# EAGLE design Motor Controller and Boost (EAGLE 8.3.0)
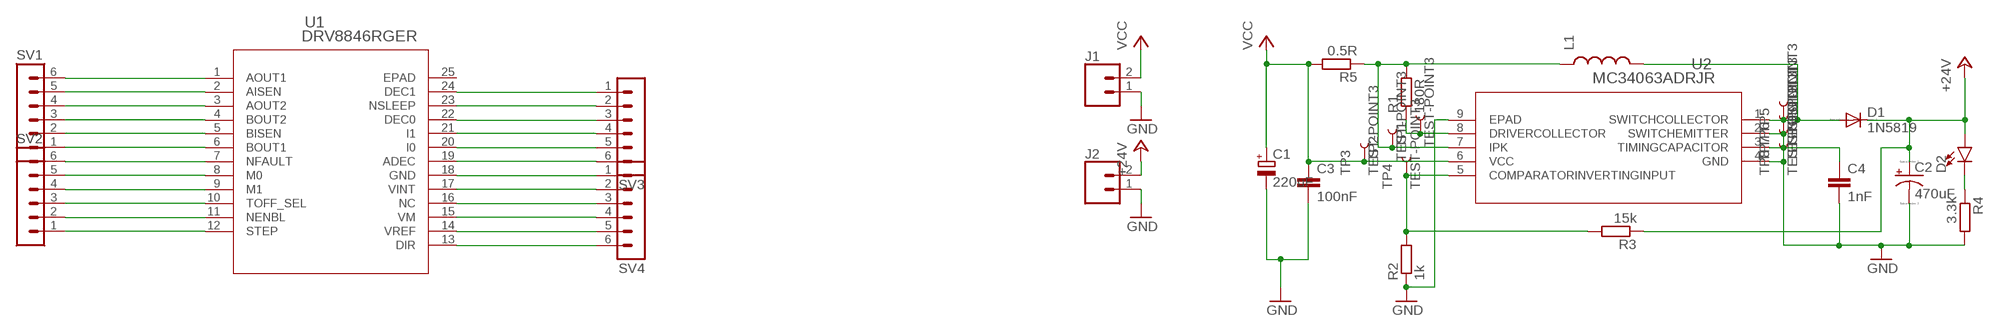
[diagram p0: schematic, sheet 1]

## Parts
C1  220uF  CPOL-EUSMCC  [SMC_C]
C2  470uF  CPOL-US153CLV-1010  [153CLV-1010]
C3  100nF  C-EUC0603  [C0603]
C4  1nF  C-EUC0603  [C0603]
D1  1N5819  [SOD123]
D2  LED0603  [LED-0603]
J1  CONN_02  [1X02]
J2  CONN_02  [1X02]
L1  INDUCTORCR54  [CR54]
R1  180R  R-EU_R0603  [R0603]
R2  1k  R-EU_R0603  [R0603]
R3  15k  R-EU_R0603  [R0603]
R4  3.3k  R-EU_R0603  [R0603]
R5  0.5R  R-EU_R0603  [R0603]
SV1  MA06-1  [MA06-1]
SV2  MA06-1  [MA06-1]
SV3  MA06-1  [MA06-1]
SV4  MA06-1  [MA06-1]
TP1  TEST-POINT3  [PAD.03X.03]
TP2  TEST-POINT3  [PAD.03X.03]
TP3  TEST-POINT3  [PAD.03X.03]
TP4  TEST-POINT3  [PAD.03X.03]
TP5  TEST-POINT3  [PAD.03X.03]
TP6  TEST-POINT3  [PAD.03X.03]
TP7  TEST-POINT3  [PAD.03X.03]
TP8  TEST-POINT3  [PAD.03X.03]
U1  DRV8846RGER  [RGE24_2P45X2P45]
U2  MC34063ADRJR  [DRJ8_2P2X3]

## Nets
+24V: C2.+ D1.C D2.A J2.2 R3.1
GND: C1.- C2.- C3.2 C4.2 J1.1 J2.1 R2.1 R4.2 TP6.P$1 TP8.P$1 U2.2(SWITCHEMITTER) U2.4(GND) U2.9(EPAD)
N$1: SV1.6 U1.1(AOUT1)
N$2: SV1.5 U1.2(AISEN)
N$3: SV1.4 U1.3(AOUT2)
N$4: SV1.3 U1.4(BOUT2)
N$5: SV1.1 U1.6(BOUT1)
N$6: SV1.2 U1.5(BISEN)
N$7: SV2.6 U1.7(NFAULT)
N$8: SV2.5 U1.8(M0)
N$9: SV2.4 U1.9(M1)
N$10: SV2.3 U1.10(TOFF_SEL)
N$11: SV2.2 U1.11(NENBL)
N$12: SV2.1 U1.12(STEP)
N$13: SV4.6 U1.13(DIR)
N$14: SV4.5 U1.14(VREF)
N$15: SV4.4 U1.15(VM)
N$16: SV4.3 U1.16(NC)
N$17: SV4.2 U1.17(VINT)
N$18: SV4.1 U1.18(GND)
N$19: SV3.6 U1.19(ADEC)
N$20: SV3.5 U1.20(I0)
N$21: SV3.4 U1.21(I1)
N$22: SV3.3 U1.22(DEC0)
N$23: SV3.2 U1.23(NSLEEP)
N$24: SV3.1 U1.24(DEC1)
N$25: R2.2 R3.2 TP4.P$1 U2.5(COMPARATORINVERTINGINPUT)
N$26: R1.1 TP1.P$1 U2.8(DRIVERCOLLECTOR)
N$28: L1.P$1 R1.2 R5.1 TP2.P$1 U2.7(IPK)
N$31: C4.1 TP7.P$1 U2.3(TIMINGCAPACITOR)
N$32: D2.C R4.1
N$33: D1.A L1.P$2 TP5.P$1 U2.1(SWITCHCOLLECTOR)
VCC: C1.+ C3.1 J1.2 R5.2 TP3.P$1 U2.6(VCC)
Unconnected: U1.25(EPAD)

## Library data of the parts
C1 = resistor:CPOL-EU: POLARIZED CAPACITOR, European symbol
C2 = resistor:CPOL-US: POLARIZED CAPACITOR, American symbol
C3 C4 = resistor:C-EU: CAPACITOR, European symbol
D1 = Beeclust:1N5819: SCHOTTKY BARRIER RECTIFIER Source: http://onsemi.com .. MBR0520LT1-D.pdf
D2 = SparkFun-LED:LED: LED (Generic) Standard schematic elements and footprints for 5mm, 3mm, 1206, and 0603 sized LEDs. Generic LEDs with no color specified.
J1 J2 = SparkFun-Connectors:CONN_02: Multi connection point. Often used as Generic Header-pin footprint for 0.1 inch spaced/style header connections On any of the 0.1 inch spaced packages, you can populate with these: Break Away Headers - Straight <https://www.sparkfun.com/products/116> (PRT-00116) Break Away Male Headers - Right Angle <https://www.sparkfun.com/products/553> (PRT-00553) Female Headers <https://www.sparkfun.com/products/115> (PRT-00115) Break Away Headers - Machine Pin <https://www.sparkfun.com/products/117> (PRT-00117) Break Away Female Headers - Swiss Machine Pin <https://www.sparkfun.com/products/743> (PRT-00743) For SCREWTERMINALS and SPRING TERMINALS visit here: Screw Terimnals on SparkFun.com <https://www.sparkfun.com/search/results?term=Screw+Terminals> (5mm/3.5mm/2.54mm spacing) This device is also useful as a general connection point to wire up your design to another part of your project. Our various solder wires solder well into these plated through hole pads. Hook-Up Wire - Assortment (Stranded, 22 AWG) <https://www.sparkfun.com/products/11375> (PRT-11375) Hook-Up Wire - Assortment (Solid Core, 22 AWG) <https://www.sparkfun.com/products/11367> (PRT-11367) View the entire wire category on our website here <https://www.sparkfun.com/categories/141> Special notes: Molex polarized connector foot print use with: PRT-08233 with associated crimp pins and housings. 2.54_SCREWTERM for use with PRT-10571. 3.5mm Screw Terminal footprints for PRT-08084 5mm Screw Terminal footprints for use with PRT-08432
L1 = adjacent-reality:INDUCTOR: Inductors Basic Inductor/Choke - 0603 and 1206. Footprints are not proven and vary greatly between part numbers. CC-BY-SA from SparkFun
R1-R5 = resistor:R-EU_: RESISTOR, European symbol
SV1-SV4 = con-lstb:MA06-1: PIN HEADER; OC_FARNELL: unknown; OC_NEWARK: unknown
TP1-TP8 = SparkFun-Connectors:TEST-POINT: SparkFun Test Points Bare copper test points for troubleshooting or In-Circuit-Testing. These are used by our Production team for verifying production board runs using pogo-pins on test beds. SparkFun Products: SparkFun LSM9DS1 Breakout <https://www.sparkfun.com/products/13284> SparkFun PSOC <https://www.sparkfun.com/products/13714> SparkFun Load Cell Amplifier <https://www.sparkfun.com/products/13879>
U1 = Beeclust:DRV8846RGER; MANUFACTURER_PART_NUMBER: drv8846rger; VENDOR: Texas Instruments
U2 = Beeclust:MC34063ADRJR; MANUFACTURER_PART_NUMBER: MC34063ADRJR; VENDOR: Vendor

## Board
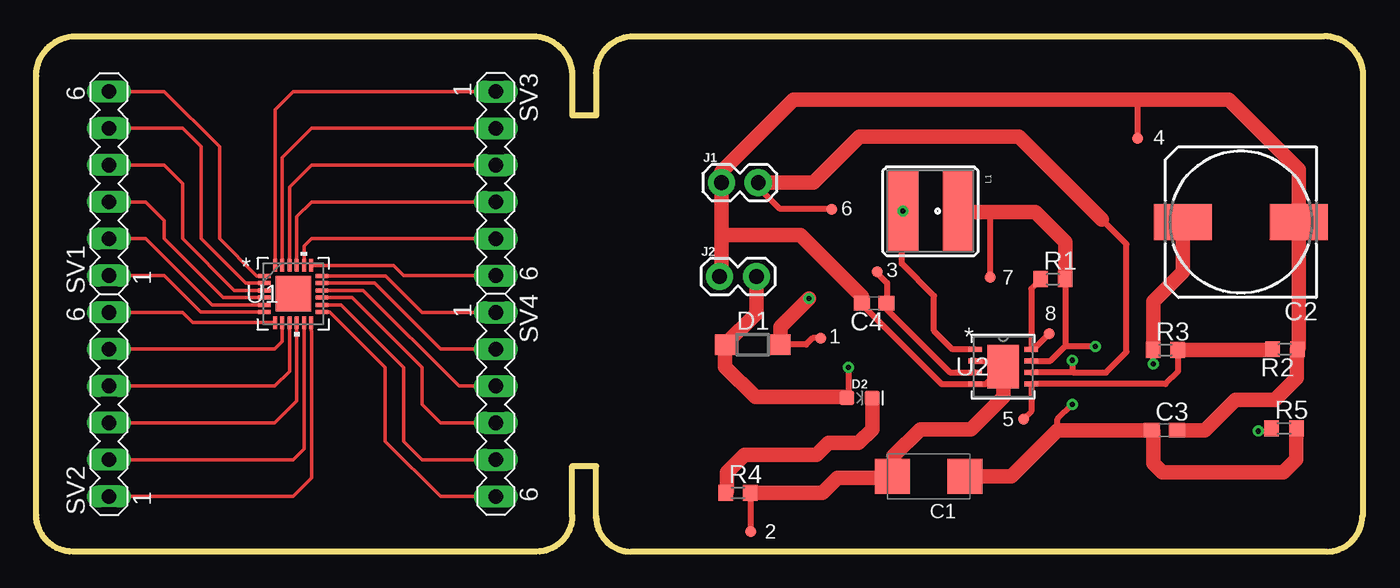
[diagram p1: board, top side]
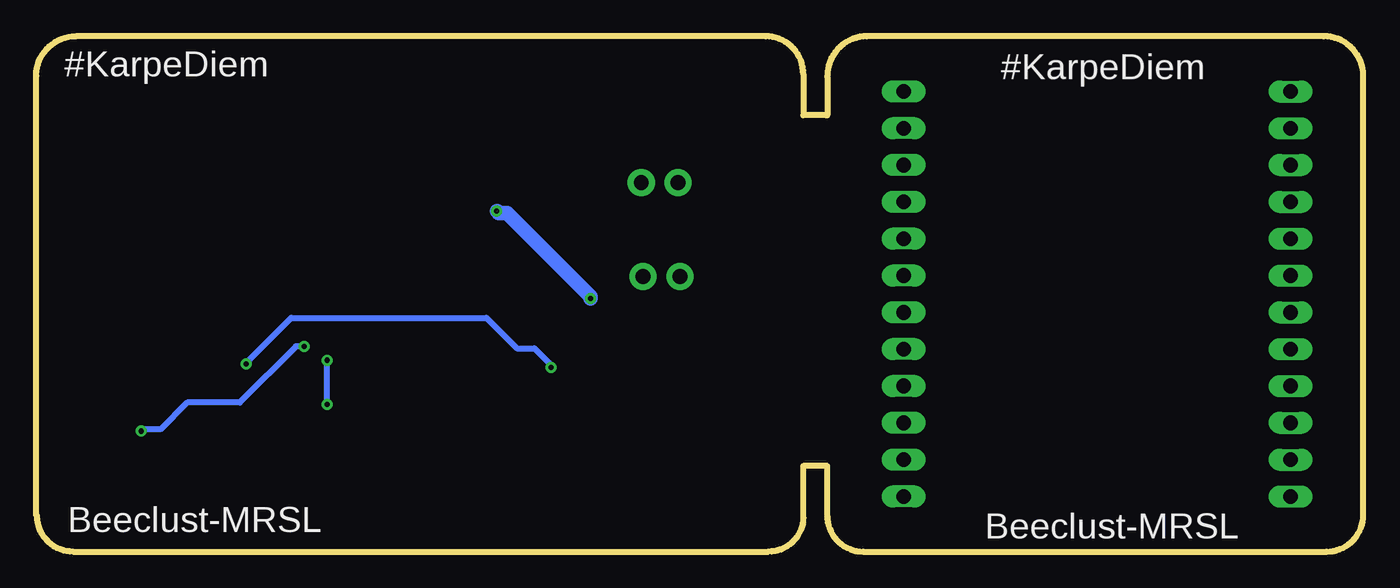
[diagram p2: board, bottom side, seen from below]

Size 91.5 x 35.56 mm. Coordinates in mm from the lower left corner, seen from the top.
Outline: 36.96,32.83 arc90 34.23,35.56 2.73,35.56 arc90 0,32.83 0,2.54 arc90 2.54,0 34.48,0 arc90 36.96,2.48
Outline: 38.61,2.41 arc90 41.02,0 88.96,0 arc90 91.44,2.48
Outline: 91.5,32.83 arc90 88.77,35.56 41.21,35.56 arc90 38.61,32.96 38.61,30.1 37.02,30.1
Outline: 91.5,2.48 91.5,33.15
Outline: 38.61,2.29 38.61,5.91 36.96,5.91 36.96,2.41
Outline: 36.96,32.77 36.96,30.1
Copper layers (1*16): Top 0.035mm / dielectric 1.5mm / Bottom 0.035mm
Design rules "default": minimum track width 10mil, minimum drill 24mil, track to track 8mil, track to pad 8mil, pad to pad 8mil, via to via 8mil, smd to smd 8mil, copper to edge 40mil, drill to drill 8mil, minimum pad ring 10mil, minimum via ring 8mil, stop-mask expansion 4mil, vias tented up to drill 0mil, thermal gap 10mil

### Footprints (pad centres in the part's own frame; a part is rotated, then mirrored left to right if it is on the bottom)
SMC_C = smd 2.4 x 2.4: + -2.5,0; - 2.5,0
153CLV-1010 = smd 4 x 2.5: + 4,0; - -4,0
C0603 = smd 1.1 x 1: 1 -0.85,0; 2 0.85,0
SOD123 = smd 1.4 x 1.4: A 1.9,0; C -1.9,0
LED-0603 = smd 1 x 1: A -0.877,0; C 0.877,0
1X02 = drill 1.016 pad 1.88: 1 0,0; 2 2.54,0
CR54 = smd 5.5 x 2.15: P$1 0,1.92; P$2 0,-1.92
R0603 = smd 1 x 1.1: 1 -0.85,0; 2 0.85,0
MA06-1 = drill 1.016 long: 1 -6.35,0; 2 -3.81,0; 3 -1.27,0; 4 1.27,0; 5 3.81,0; 6 6.35,0
PAD.03X.03 = smd 0.762 x 0.762: P$1 0,0
RGE24_2P45X2P45 = smd 0.85 x 0.28: 1 -1.975,1.25; 2 -1.975,0.75; 3 -1.975,0.25; 4 -1.975,-0.25; 5 -1.975,-0.75; 6 -1.975,-1.25; 13 1.975,-1.25; 14 1.975,-0.75; 15 1.975,-0.25; 16 1.975,0.25; 17 1.975,0.75; 18 1.975,1.25 | smd 0.28 x 0.85: 7 -1.25,-1.975; 8 -0.75,-1.975; 9 -0.25,-1.975; 10 0.25,-1.975; 11 0.75,-1.975; 12 1.25,-1.975; 19 1.25,1.975; 20 0.75,1.975; 21 0.25,1.975; 22 -0.25,1.975; 23 -0.75,1.975; 24 -1.25,1.975 | smd 2.45 x 2.45: 25 0,0
DRJ8_2P2X3 = smd 0.95 x 0.35: 1 -1.93,1.2; 2 -1.93,0.4; 3 -1.93,-0.4; 4 -1.93,-1.2; 5 1.93,-1.2; 6 1.93,-0.4; 7 1.93,0.4; 8 1.93,1.2 | smd 2.2 x 3: 9 0,0

### Placement (x,y rotation side)
C1  61.53,5.21 180 top
C2  83.06,22.73 180 top
C3  77.79,8.38 0 top
C4  57.79,17.14 180 top
D1  49.4,14.29 0 top
D2  56.77,10.6 0 top
J1  47.24,25.46 0 top
J2  47.12,18.99 0 top
L1  61.66,23.5 270 top
R1  70.1,18.8 0 top
R2  86.11,13.97 180 top
R3  77.85,13.91 0 top
R4  48.39,4.06 0 top
R5  86.04,8.51 0 top
SV1  5.02,25.4 90 top
SV2  5.02,10.16 90 top
SV3  31.69,25.4 270 top
SV4  31.69,10.16 270 top
TP1  69.85,15.05 0 top
TP2  65.79,18.92 0 top
TP3  54.86,23.62 0 top
TP4  68.07,9.14 0 top
TP5  54.1,14.73 0 top
TP6  49.28,1.4 0 top
TP7  57.98,19.3 0 top
TP8  75.95,28.51 0 top
U1  17.72,17.78 0 top
U2  66.67,12.76 0 top

### Tracks (layer width: path | path; a pad name or v marks a point on that pad's centre or on a via)
+24V  (via drill 0.35)
  Top 0.406: R3.1 77,12.98 v77.03,12.95 | v56.01,12.7 56.01,10.72 D2.A
  Top 1.016: C2.+ 79.06,19.3 77.03,17.27 77.03,13.93 R3.1 | D2.A 55.83,10.67 49.59,10.67 47.5,12.76 D1.C 49.66,16.44 J2.2
  Bottom 0.406: v77.03,12.95 77.03,13.02 73.91,16.13 60.45,16.13 58.36,14.03 57.15,14.03 55.94,12.83 55.94,12.76 v56.01,12.7
GND
  Top 0.406: C4.2 56.93,17.04 62.42,11.56 U2.4 65.47,11.56 U2.9 66.27,13.16 U2.2 | 59.12,6.79 59.12,6.61 59.12,6.04 | R4.2 49.24,1.44 TP6.P$1 | TP8.P$1 75.95,31.06 75.83,31.18
  Top 1.016: 47.24,21.83 J1.1 47.24,26.23 52.2,31.18 75.83,31.18 82.23,31.18 87.06,26.35 C2.- 87.06,14.07 R2.1 86.93,13.95 86.93,12 85.41,10.48 82.68,10.48 80.58,8.38 C3.2 | 47.24,21.83 47.24,19.11 J2.1 | R4.2 54.23,4.06 55.25,5.08 58.9,5.08 C1.- 59.03,5.95 59.12,6.04 | C4.2 56.93,17.61 52.71,21.84 47.26,21.84 47.24,21.83 | U2.9 66.68,10.67 64.45,8.45 60.95,8.45 59.12,6.61
N$1
  Top 0.254: U1.1 15.2,19.03 12.64,21.59 12.64,27.94 8.83,31.75 SV1.6
N$2
  Top 0.254: U1.2 14.43,18.53 11.37,21.59 11.37,27.94 10.1,29.21 SV1.5
N$3
  Top 0.254: U1.3 13.66,18.03 10.1,21.59 10.1,25.4 8.83,26.67 SV1.4
N$4
  Top 0.254: U1.4 12.89,17.53 8.83,21.59 8.83,22.86 7.56,24.13 SV1.3
N$5
  Top 0.254: U1.6 11.35,16.53 8.83,19.05 SV1.1
N$6
  Top 0.254: U1.5 12.12,17.03 7.56,21.59 SV1.2
N$7
  Top 0.254: U1.7 10.8,15.8 10.1,16.51 SV2.6
N$8
  Top 0.254: U1.8 16.97,14.49 16.45,13.97 SV2.5
N$9
  Top 0.254: U1.9 17.47,12.45 16.45,11.43 SV2.4
N$10
  Top 0.254: U1.10 17.97,10.41 16.45,8.89 SV2.3
N$11
  Top 0.254: U1.11 18.47,7.1 17.72,6.35 SV2.2
N$12
  Top 0.254: U1.12 18.97,15.26 18.99,15.24 18.99,5.08 17.72,3.81 SV2.1
N$13
  Top 0.254: U1.13 20.24,16.53 24.07,12.7 24.07,7.62 27.88,3.81 SV4.6
N$14
  Top 0.254: U1.14 21.01,17.03 25.34,12.7 25.34,7.62 26.61,6.35 SV4.5
N$15
  Top 0.254: U1.15 21.78,17.53 26.61,12.7 26.61,10.16 27.88,8.89 SV4.4
N$16
  Top 0.254: U1.16 22.55,18.03 29.15,11.43 SV4.3
N$17
  Top 0.254: U1.17 23.32,18.53 27.88,13.97 SV4.2
N$18
  Top 0.254: U1.18 24.09,19.03 26.61,16.51 SV4.1
N$19
  Top 0.254: U1.19 24.63,19.75 25.34,19.05 SV3.6
N$20
  Top 0.254: U1.20 18.47,21.07 18.99,21.59 SV3.5
N$21
  Top 0.254: U1.21 17.97,23.11 18.99,24.13 SV3.4
N$22
  Top 0.254: U1.22 17.47,25.15 18.99,26.67 SV3.3
N$23
  Top 0.254: U1.23 16.97,27.19 18.99,29.21 SV3.2
N$24
  Top 0.254: U1.24 16.47,30.5 17.72,31.75 SV3.1
N$25
  Top 0.406: R3.2 78.74,13.87 78.74,12.45 77.86,11.56 U2.5 68.61,9.68 TP4.P$1
  Top 1.016: R3.2 85.19,13.91 R2.2
N$26
  Top 0.406: R1.1 68.61,18.15 U2.8 68.76,13.96 TP1.P$1
N$27  (via drill 0.35)
  other vias: 59.75,23.5
N$28  (via drill 0.35)
  Top 0.406: R1.2 70.95,14.19 | U2.7 69.93,13.16 70.95,14.19 | 70.95,14.19 73,14.19 v73.02,14.16 | v84.26,8.32 85,8.32 R5.1 | TP2.P$1 65.79,23.04 66.17,23.43
  Top 1.016: R1.2 70.95,21.38 68.9,23.43 66.17,23.43 63.64,23.43 L1.P$1
  Bottom 0.406: v73.02,14.16 73.6,14.16 77.47,10.29 81.09,10.29 82.93,8.45 84.14,8.45 v84.26,8.32
N$31
  Top 0.406: 58.64,16.92 C4.1 | 58.64,16.92 58.64,16.74 62.99,12.38 64.73,12.38 U2.3 | TP7.P$1 57.98,19.24 58.67,18.54 58.67,16.96 58.64,16.92
N$32
  Top 1.016: R4.1 47.62,4.15 47.62,5.46 48.83,6.67 53.78,6.67 54.61,7.49 56.71,7.49 57.65,8.43 D2.C
N$33  (via drill 0.35)  (1 unrouted)
  Top 0.406: U2.1 63.19,13.96 61.91,15.24 61.91,17.65 59.69,19.88 59.69,23.45 L1.P$2 | TP5.P$1 53.53,14.73 53.09,14.29 D1.A
  Top 1.016: D1.A 51.3,15.49 v53.28,17.46
  Bottom 1.016: v53.28,17.46 53.28,17.59 59.05,23.37 59.61,23.37 L1.P$2
VCC  (via drill 0.35)
  Top 0.406: 71.52,12.36 U2.6 | 71.52,12.36 73.77,12.36 75.18,13.78 75.18,21.21 73.47,22.92 | 70.42,8.38 70.42,9.14 v71.44,10.16 | v71.44,13.21 71.44,12.45 71.52,12.36 | J1.2 49.78,25.15 51.24,23.69 54.8,23.69 TP3.P$1
  Top 1.016: R5.2 86.89,6.38 85.98,5.46 77.66,5.46 77.03,6.1 77.03,8.29 C3.1 70.42,8.38 67.25,5.21 C1.+ | J1.2 53.59,25.46 56.77,28.64 67.75,28.64 73.47,22.92
  Bottom 0.406: v71.44,10.16 v71.44,13.21

### Text on the board
tNames: 4 | 6 | 3 | 7 | 8 | 1 | 5 | 2
bNames: #KarpeDiem | #KarpeDiem | Beeclust-MRSL | Beeclust-MRSL